# Altium schematic sheet Ports_2.SchDoc
size A4
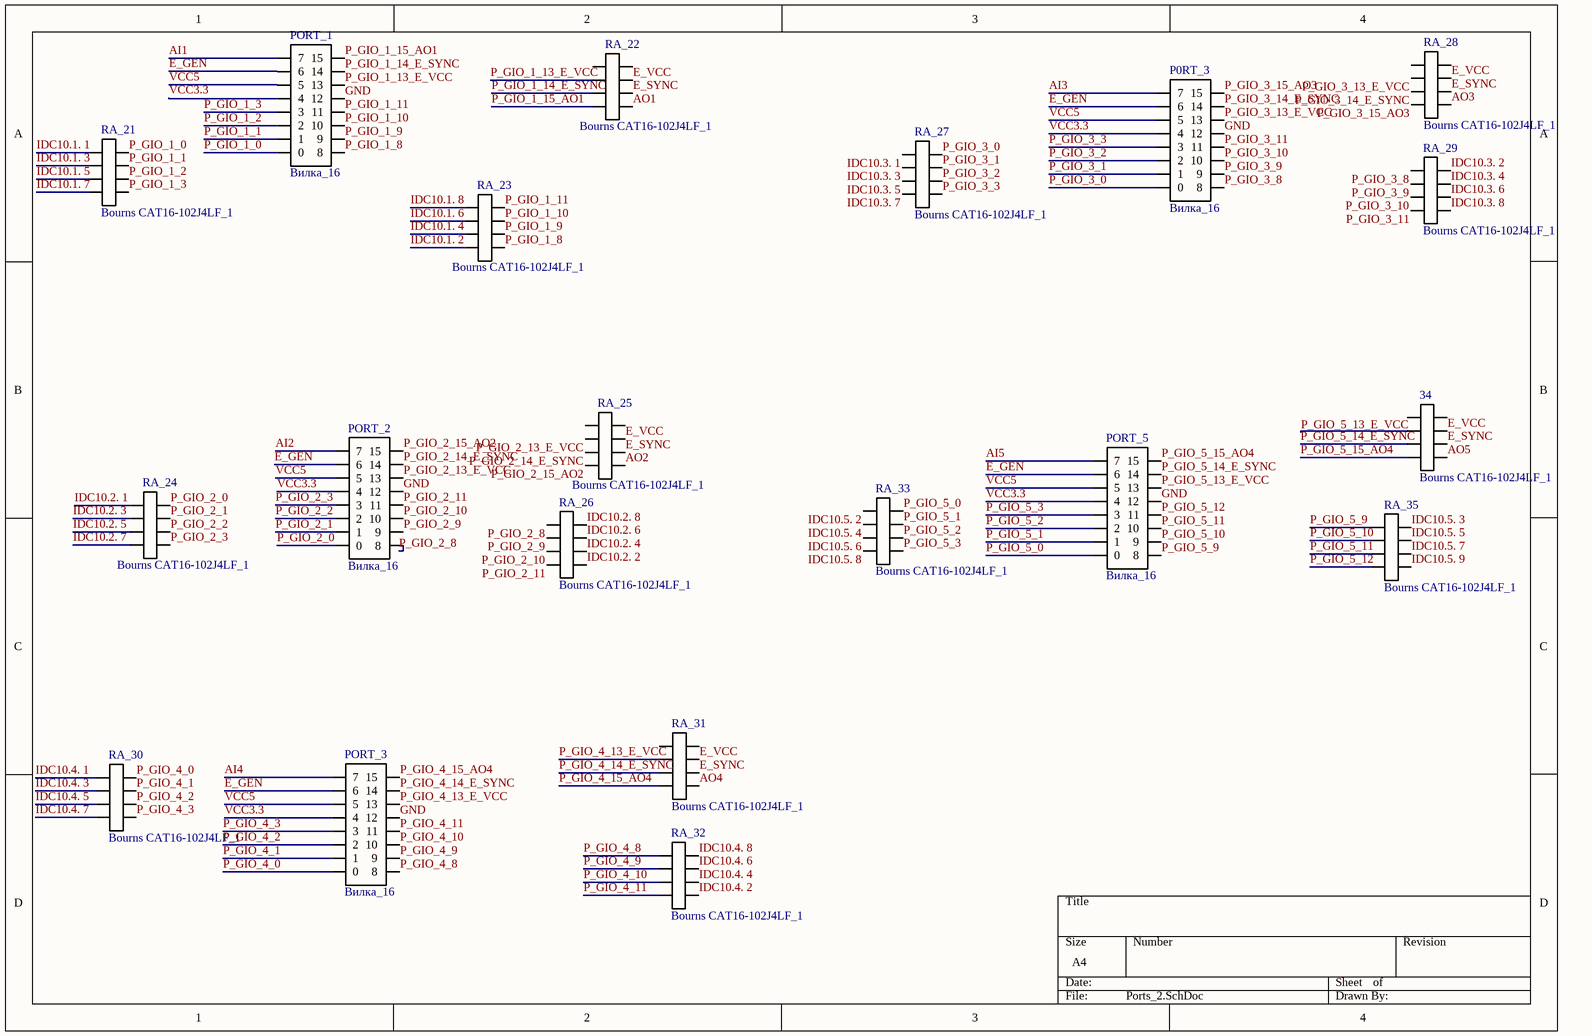
[diagram p0: Ports_2.SchDoc]

## Parts
34  Bourns CAT16-102J4LF_1  [CAT16-102J4LF_2]
P0RT_3  Вилка_16  [DS1013-16]
PORT_1  Вилка_16  [DS1013-16]
PORT_2  Вилка_16  [DS1013-16]
PORT_3  Вилка_16  [DS1013-16]
PORT_5  Вилка_16  [DS1013-16]
RA_21  Bourns CAT16-102J4LF_1  [CAT16-102J4LF_2]
RA_22  Bourns CAT16-102J4LF_1  [CAT16-102J4LF_2]
RA_23  Bourns CAT16-102J4LF_1  [CAT16-102J4LF_2]
RA_24  Bourns CAT16-102J4LF_1  [CAT16-102J4LF_2]
RA_25  Bourns CAT16-102J4LF_1  [CAT16-102J4LF_2]
RA_26  Bourns CAT16-102J4LF_1  [CAT16-102J4LF_2]
RA_27  Bourns CAT16-102J4LF_1  [CAT16-102J4LF_2]
RA_28  Bourns CAT16-102J4LF_1  [CAT16-102J4LF_2]
RA_29  Bourns CAT16-102J4LF_1  [CAT16-102J4LF_2]
RA_30  Bourns CAT16-102J4LF_1  [CAT16-102J4LF_2]
RA_31  Bourns CAT16-102J4LF_1  [CAT16-102J4LF_2]
RA_32  Bourns CAT16-102J4LF_1  [CAT16-102J4LF_2]
RA_33  Bourns CAT16-102J4LF_1  [CAT16-102J4LF_2]
RA_35  Bourns CAT16-102J4LF_1  [CAT16-102J4LF_2]

## Nets
AI1: PORT_1.7
AI2: PORT_2.7
AI3: P0RT_3.7
AI4: PORT_3.7
AI5: PORT_5.7
AO1: RA_22.4
AO2: RA_25.4
AO3: RA_28.0
AO4: RA_31.4
AO5: 34.0
E_GEN: P0RT_3.6 PORT_1.6 PORT_2.6 PORT_3.6 PORT_5.6
E_SYNC: 34.1 RA_22.5 RA_25.5 RA_28.1 RA_31.5
E_VCC: 34.2 RA_22.6 RA_25.6 RA_28.2 RA_31.6
GND: P0RT_3.12 PORT_1.12 PORT_2.12 PORT_3.12 PORT_5.12
IDC10.1. 1: RA_21.4
IDC10.1. 2: RA_23.3
IDC10.1. 3: RA_21.5
IDC10.1. 4: RA_23.2
IDC10.1. 5: RA_21.6
IDC10.1. 6: RA_23.1
IDC10.1. 7: RA_21.7
IDC10.1. 8: RA_23.0
IDC10.2. 1: RA_24.0
IDC10.2. 2: RA_26.0
IDC10.2. 3: RA_24.1
IDC10.2. 4: RA_26.1
IDC10.2. 5: RA_24.2
IDC10.2. 6: RA_26.2
IDC10.2. 7: RA_24.3
IDC10.2. 8: RA_26.3
IDC10.3. 1: RA_27.4
IDC10.3. 2: RA_29.3
IDC10.3. 3: RA_27.5
IDC10.3. 4: RA_29.2
IDC10.3. 5: RA_27.6
IDC10.3. 6: RA_29.1
IDC10.3. 7: RA_27.7
IDC10.3. 8: RA_29.0
IDC10.4. 1: RA_30.4
IDC10.4. 2: RA_32.0
IDC10.4. 3: RA_30.5
IDC10.4. 4: RA_32.1
IDC10.4. 5: RA_30.6
IDC10.4. 6: RA_32.2
IDC10.4. 7: RA_30.7
IDC10.4. 8: RA_32.3
IDC10.5. 2: RA_33.4
IDC10.5. 3: RA_35.3
IDC10.5. 4: RA_33.5
IDC10.5. 5: RA_35.2
IDC10.5. 6: RA_33.6
IDC10.5. 7: RA_35.1
IDC10.5. 8: RA_33.7
IDC10.5. 9: RA_35.0
P_GIO_1_0: PORT_1.0 RA_21.3
P_GIO_1_1: PORT_1.1 RA_21.2
P_GIO_1_2: PORT_1.2 RA_21.1
P_GIO_1_3: PORT_1.3 RA_21.0
P_GIO_1_8: PORT_1.8 RA_23.4
P_GIO_1_9: PORT_1.9 RA_23.5
P_GIO_1_10: PORT_1.10 RA_23.6
P_GIO_1_11: PORT_1.11 RA_23.7
P_GIO_1_13_E_VCC: PORT_1.13 RA_22.1
P_GIO_1_14_E_SYNC: PORT_1.14 RA_22.2
P_GIO_1_15_AO1: PORT_1.15 RA_22.3
P_GIO_2_0: PORT_2.0 RA_24.7
P_GIO_2_1: PORT_2.1 RA_24.6
P_GIO_2_2: PORT_2.2 RA_24.5
P_GIO_2_3: PORT_2.3 RA_24.4
P_GIO_2_8: PORT_2.8 RA_26.4
P_GIO_2_9: PORT_2.9 RA_26.5
P_GIO_2_10: PORT_2.10 RA_26.6
P_GIO_2_11: PORT_2.11 RA_26.7
P_GIO_2_13_E_VCC: PORT_2.13 RA_25.1
P_GIO_2_14_E_SYNC: PORT_2.14 RA_25.2
P_GIO_2_15_AO2: PORT_2.15 RA_25.3
P_GIO_3_0: P0RT_3.0 RA_27.3
P_GIO_3_1: P0RT_3.1 RA_27.2
P_GIO_3_2: P0RT_3.2 RA_27.1
P_GIO_3_3: P0RT_3.3 RA_27.0
P_GIO_3_8: P0RT_3.8 RA_29.4
P_GIO_3_9: P0RT_3.9 RA_29.5
P_GIO_3_10: P0RT_3.10 RA_29.6
P_GIO_3_11: P0RT_3.11 RA_29.7
P_GIO_3_13_E_VCC: P0RT_3.13 RA_28.5
P_GIO_3_14_E_SYNC: P0RT_3.14 RA_28.6
P_GIO_3_15_AO3: P0RT_3.15 RA_28.7
P_GIO_4_0: PORT_3.0 RA_30.3
P_GIO_4_1: PORT_3.1 RA_30.2
P_GIO_4_2: PORT_3.2 RA_30.1
P_GIO_4_3: PORT_3.3 RA_30.0
P_GIO_4_8: PORT_3.8 RA_32.4
P_GIO_4_9: PORT_3.9 RA_32.5
P_GIO_4_10: PORT_3.10 RA_32.6
P_GIO_4_11: PORT_3.11 RA_32.7
P_GIO_4_13_E_VCC: PORT_3.13 RA_31.1
P_GIO_4_14_E_SYNC: PORT_3.14 RA_31.2
P_GIO_4_15_AO4: PORT_3.15 RA_31.3
P_GIO_5_0: PORT_5.0 RA_33.3
P_GIO_5_1: PORT_5.1 RA_33.2
P_GIO_5_2: PORT_5.2 RA_33.1
P_GIO_5_3: PORT_5.3 RA_33.0
P_GIO_5_9: PORT_5.8 RA_35.4
P_GIO_5_10: PORT_5.9 RA_35.5
P_GIO_5_11: PORT_5.10 RA_35.6
P_GIO_5_12: PORT_5.11 RA_35.7
P_GIO_5_13_E_VCC: 34.5 PORT_5.13
P_GIO_5_14_E_SYNC: 34.6 PORT_5.14
P_GIO_5_15_AO4: 34.7 PORT_5.15
VCC3.3: P0RT_3.4 PORT_1.4 PORT_2.4 PORT_3.4 PORT_5.4
VCC5: P0RT_3.5 PORT_1.5 PORT_2.5 PORT_3.5 PORT_5.5

Not connected (* = marked no-connect by the designer): 34 3 4; RA_22 0 7; RA_25 0 7; RA_28 3 4; RA_31 0 7

## Library data of the parts
P0RT_3 PORT_1-PORT_3 PORT_5 = DS1013-16: 16_pin